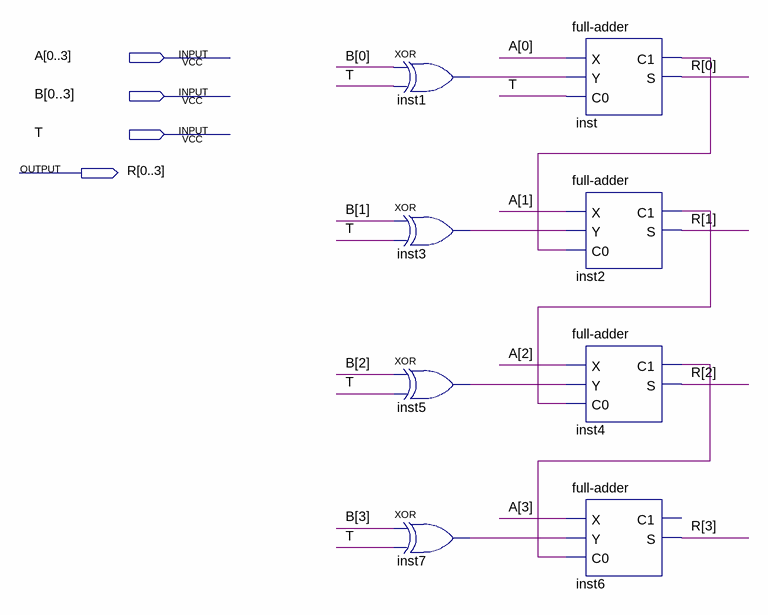
[diagram p0: schematic sheet]
// Quartus schematic sum.bdf as structural Verilog: 8 symbols, 4 pins
module sum (
  input  [0:3] A,
  input  [0:3] B,
  input  T,
  output [0:3] R
);

  wire inst1_out, inst2_c1, inst3_out, inst4_c1, inst5_out, inst7_out, inst_c1;

  xor inst1 (inst1_out, B[0], T);
  xor inst3 (inst3_out, B[1], T);
  xor inst5 (inst5_out, B[2], T);
  xor inst7 (inst7_out, B[3], T);
  \full-adder  inst (.X(A[0]), .Y(inst1_out), .C0(T), .C1(inst_c1), .S(R[0]));
  \full-adder  inst2 (.X(A[1]), .Y(inst3_out), .C0(inst_c1), .C1(inst2_c1), .S(R[1]));
  \full-adder  inst4 (.X(A[2]), .Y(inst5_out), .C0(inst2_c1), .C1(inst4_c1), .S(R[2]));
  \full-adder  inst6 (.X(A[3]), .Y(inst7_out), .C0(inst4_c1), .S(R[3]));  // open: C1
endmodule
